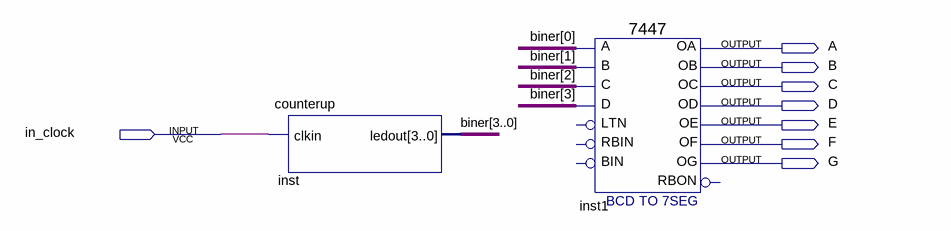
[diagram p0: schematic sheet]
// Quartus schematic mod9.bdf as structural Verilog: 2 symbols, 8 pins
module mod9 (
  input  in_clock,
  output A,
  output B,
  output C,
  output D,
  output E,
  output F,
  output G
);

  wire [3:0] biner;

  counterup inst (.clkin(in_clock), .ledout(biner));
  \7447  inst1 (
    .B(biner[1]), .C(biner[2]), .D(biner[3]), .A(biner[0]), .OB(B), .OC(C), .OE(E), .OD(D), .OF(F), .OG(G),
    .OA(A));  // open: LTN, RBIN, BIN, RBON
endmodule
